# Altium schematic sheet Copy of Archimedes_Islemci_Katı.SchDoc: Kontrolcü Katı Tasarımı
size A4; DrawnBy: Emre Rasim; DocumentNumber: 8; Revision: 1.0; SheetNumber: 2; SheetTotal: 7
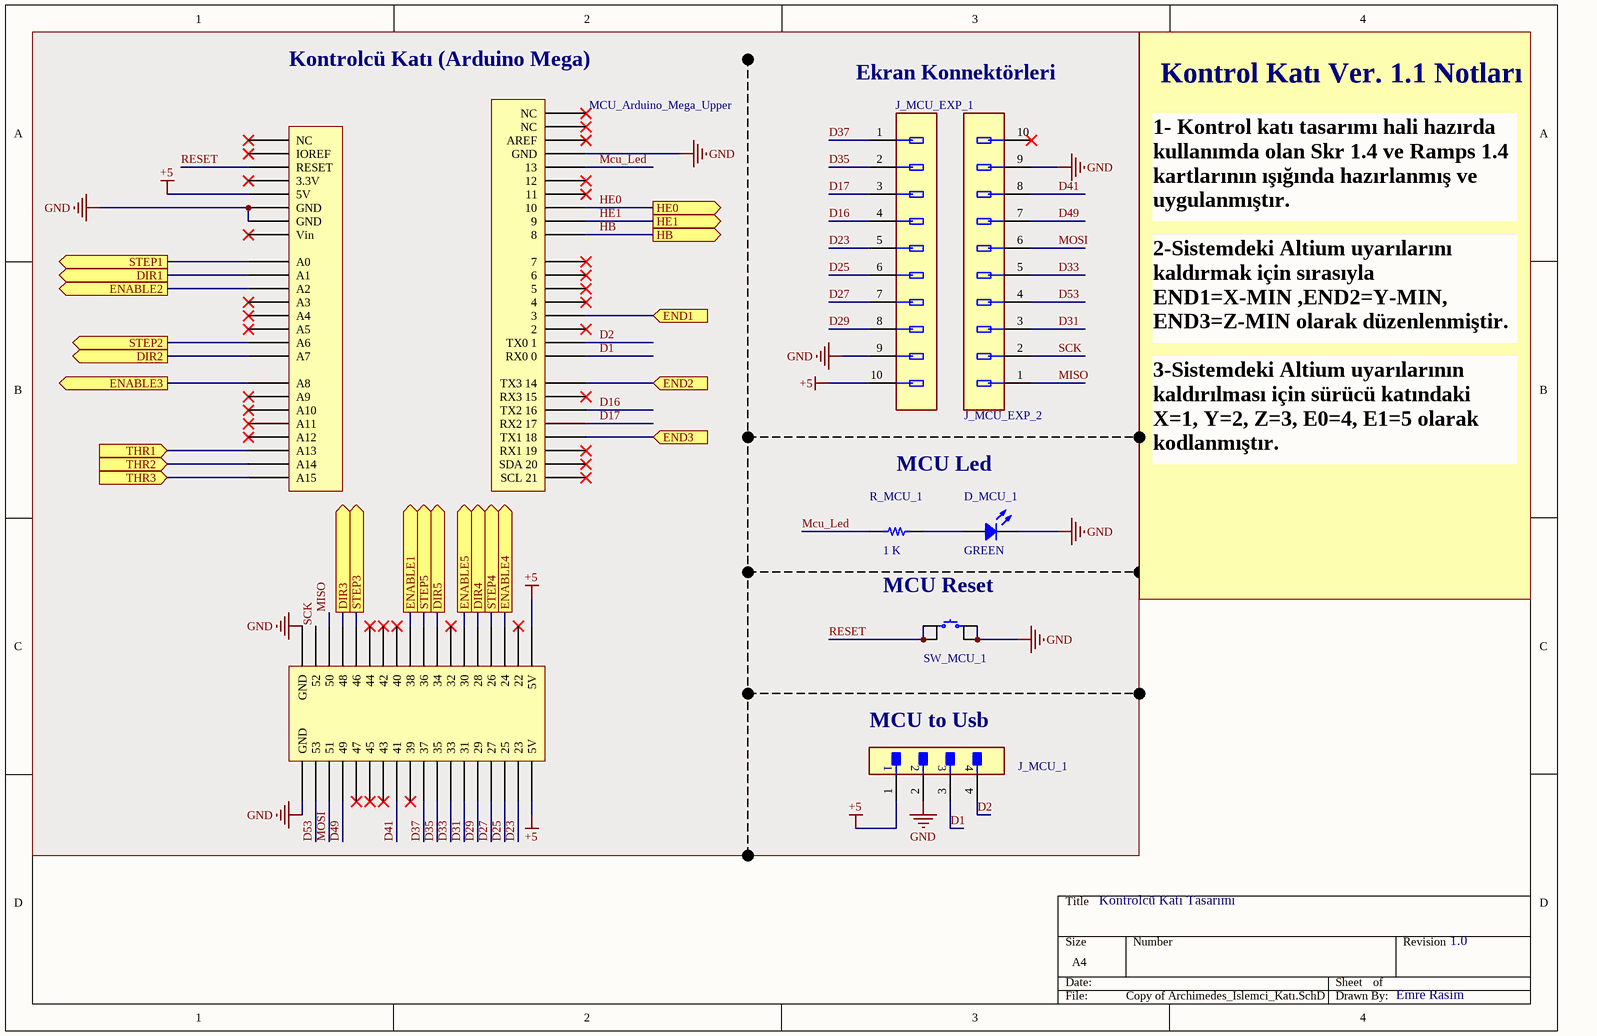
[diagram p0: Copy of Archimedes_Islemci_Katı.SchDoc]

## Parts
D_MCU_1  GREEN  [LED 0805/2012 GREEN]
J_MCU_1  2.5 mm locked  [CON_2.5MM_4_LEAD_180_LOCKED]  (value not drawn)
J_MCU_EXP_1  Con_2.54mm_10 lead_2 row_Ipc connector  [Con_10pin_2row_ıpc_connector]  (value not drawn)
J_MCU_EXP_2  Con_2.54mm_10 lead_2 row_Ipc connector  [Con_10pin_2row_ıpc_connector]  (value not drawn)
MCU_Arduino_Mega_Upper  Arduino Mega 2560  [MCU_Arduino_MEGA_Upper]  (value not drawn)
R_MCU_1  1 K  [RES 0805/2012]
SW_MCU_1  Push button with 6x6 landmark  [SW_PUSH_6X6mm]  (value not drawn)

## Ports
DIR1 (out), DIR2 (out), DIR3 (out), DIR4 (out), DIR5 (out), ENABLE1 (out), ENABLE2 (out), ENABLE3 (out), ENABLE4 (out), ENABLE5 (out), END1 (in), END2 (in), END3 (in), HB (out), HE0 (out), HE1 (out), STEP1 (out), STEP2 (out), STEP3 (out), STEP4 (out), STEP5 (out), THR1 (in), THR2 (in), THR3 (in)

## Nets
+5: J_MCU_1.1 J_MCU_EXP_1.10 MCU_Arduino_Mega_Upper.1(5V) MCU_Arduino_Mega_Upper.2(5V) MCU_Arduino_Mega_Upper.56(5V)
GND: D_MCU_1.2 J_MCU_1.2 J_MCU_EXP_1.9 J_MCU_EXP_2.9 MCU_Arduino_Mega_Upper.35(GND) MCU_Arduino_Mega_Upper.36(GND) MCU_Arduino_Mega_Upper.54(GND) MCU_Arduino_Mega_Upper.55(GND) MCU_Arduino_Mega_Upper.83(GND) SW_MCU_1.3 SW_MCU_1.4
D1: J_MCU_1.3 MCU_Arduino_Mega_Upper.69(RX0_0)
D2: J_MCU_1.4 MCU_Arduino_Mega_Upper.70(TX0_1)
D16: J_MCU_EXP_1.4 MCU_Arduino_Mega_Upper.66(TX2_16)
D17: J_MCU_EXP_1.3 MCU_Arduino_Mega_Upper.65(RX2_17)
D23: J_MCU_EXP_1.5 MCU_Arduino_Mega_Upper.4(23)
D25: J_MCU_EXP_1.6 MCU_Arduino_Mega_Upper.6(25)
D27: J_MCU_EXP_1.7 MCU_Arduino_Mega_Upper.8(27)
D29: J_MCU_EXP_1.8 MCU_Arduino_Mega_Upper.10(29)
D31: J_MCU_EXP_2.3 MCU_Arduino_Mega_Upper.12(31)
D33: J_MCU_EXP_2.5 MCU_Arduino_Mega_Upper.14(33)
D35: J_MCU_EXP_1.2 MCU_Arduino_Mega_Upper.16(35)
D37: J_MCU_EXP_1.1 MCU_Arduino_Mega_Upper.18(37)
D41: J_MCU_EXP_2.8 MCU_Arduino_Mega_Upper.22(41)
D49: J_MCU_EXP_2.7 MCU_Arduino_Mega_Upper.30(49)
D53: J_MCU_EXP_2.4 MCU_Arduino_Mega_Upper.34(53)
DIR1: MCU_Arduino_Mega_Upper.51(A1) ; port DIR1
DIR2: MCU_Arduino_Mega_Upper.45(A7) ; port DIR2
DIR3: MCU_Arduino_Mega_Upper.29(48) ; port DIR3
DIR4: MCU_Arduino_Mega_Upper.9(28) ; port DIR4
DIR5: MCU_Arduino_Mega_Upper.15(34) ; port DIR5
ENABLE1: MCU_Arduino_Mega_Upper.19(38) ; port ENABLE1
ENABLE2: MCU_Arduino_Mega_Upper.50(A2) ; port ENABLE2
ENABLE3: MCU_Arduino_Mega_Upper.44(A8) ; port ENABLE3
ENABLE4: MCU_Arduino_Mega_Upper.5(24) ; port ENABLE4
ENABLE5: MCU_Arduino_Mega_Upper.11(30) ; port ENABLE5
END1: MCU_Arduino_Mega_Upper.72(3) ; port END1
END2: MCU_Arduino_Mega_Upper.68(TX3_14) ; port END2
END3: MCU_Arduino_Mega_Upper.64(TX1_18) ; port END3
HB: MCU_Arduino_Mega_Upper.77(8) ; port HB
HE0: MCU_Arduino_Mega_Upper.79(10) ; port HE0
HE1: MCU_Arduino_Mega_Upper.78(9) ; port HE1
Mcu_Led: MCU_Arduino_Mega_Upper.82(13) R_MCU_1.1
MISO: J_MCU_EXP_2.1 MCU_Arduino_Mega_Upper.31(50)
MOSI: J_MCU_EXP_2.6 MCU_Arduino_Mega_Upper.32(51)
RESET: MCU_Arduino_Mega_Upper.58(RESET) SW_MCU_1.1 SW_MCU_1.2
SCK: J_MCU_EXP_2.2 MCU_Arduino_Mega_Upper.33(52)
STEP1: MCU_Arduino_Mega_Upper.52(A0) ; port STEP1
STEP2: MCU_Arduino_Mega_Upper.46(A6) ; port STEP2
STEP3: MCU_Arduino_Mega_Upper.27(46) ; port STEP3
STEP4: MCU_Arduino_Mega_Upper.7(26) ; port STEP4
STEP5: MCU_Arduino_Mega_Upper.17(36) ; port STEP5
THR1: MCU_Arduino_Mega_Upper.39(A13) ; port THR1
THR2: MCU_Arduino_Mega_Upper.38(A14) ; port THR2
THR3: MCU_Arduino_Mega_Upper.37(A15) ; port THR3
NetD_MCU_1_1: D_MCU_1.1 R_MCU_1.2

Not connected (* = marked no-connect by the designer): J_MCU_EXP_2 10*; MCU_Arduino_Mega_Upper 3(22)* 13(32)* 20(39)* 21(40)* 23(42)* 24(43)* 25(44)* 26(45)* 28(47)* 40(A12)* 41(A11)* 42(A10)* 43(A9)* 47(A5)* 48(A4)* 49(A3)* 53(Vin)* 57(3.3V)* 59(IOREF)* 60(NC)* 61(SCL_21)* 62(SDA_20)* 63(RX1_19)* 67(RX3_15)* 71(2)* 73(4)* 74(5)* 75(6)* 76(7)* 80(11)* 81(12)* 84(AREF)* 85(NC)* 86(NC)*

## Notes on the sheet
- (near MCU_Arduino_Mega_Upper) Kontrolcü Katı (Arduino Mega)
- Ekran Konnektörleri
- Kontrol Katı Ver. 1.1 Notları
- 1- Kontrol katı tasarımı hali hazırda kullanımda olan Skr 1.4 ve Ramps 1.4 kartlarının ışığında hazırlanmış ve uygulanmıştır.
- 2-Sistemdeki Altium uyarılarını kaldırmak için sırasıyla END1=X-MIN ,END2=Y-MIN, END3=Z-MIN olarak düzenlenmiştir.
- MCU Led
- 3-Sistemdeki Altium uyarılarının kaldırılması için sürücü katındaki X=1, Y=2, Z=3, E0=4, E1=5 olarak kodlanmıştır.
- MCU Reset
- (near J_MCU_1) MCU to Usb

## Library data of the parts
D_MCU_1 = LED 805
J_MCU_1 = Con_2.5mm_4_lead_180_locked: 2.5 mm 4 lead locked connector
J_MCU_EXP_1 J_MCU_EXP_2 = Con_2.54mm_10 lead_2 row_Ipc connector: CONN 10 Positions Header Connector 0.100" (2.54mm) Through Hole Gold; Manufacturer: Molex; Part Number: 70246-1001; Voltage: 250V; Current - Maximum per Contact: 2.5A; Number of Circuits: 10; helpURL: https://upverter.com/upn/revision/723849a355ae3f31/; ComponentLink2Description: Datasheet; Temperature: -55°C to +120°C; Package: HDR10; Supplier 2: Mouser; Supplier 1: Digi-Key; ComponentLink1URL: https://upverter.com/upn/revision/723849a355ae3f31/; Supplier Part Number 2: 538-70246-1001; Supplier Part Number 1: WM9219-ND; ComponentLink1Description: Upverter; ComponentLink2URL: http://www.molex.com/pdm_docs/sd/702461001_sd.pdf; RoHS: TRUE; Mouser Part Number: 538-70246-1001; Temperature Range High: +120°C; Digikey Description: CONN 10 Positions Header Connector 0.100" (2.54mm) Through Hole Gold; Digikey Part Number: WM9219-ND; Lead Free: yes; Temperature Range Low: -55°C; Pitch: 2.54mm
MCU_Arduino_Mega_Upper = MCU_Arduino_Mega_Upper
R_MCU_1 = Resistor 805
SW_MCU_1 = SW_PUSH_6X6mm